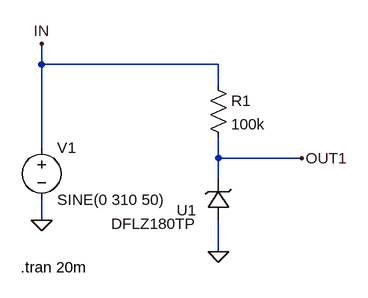
[diagram p0: schematic DFLZ180TP.asc]
DFLZ180TP.asc, the LTspice schematic file:
Version 4.1
SHEET 1 880 680
WIRE -16 32 -16 0
WIRE 256 32 -16 32
WIRE 256 64 256 32
WIRE -16 160 -16 32
WIRE 256 176 256 144
WIRE 384 176 256 176
WIRE 256 208 256 176
WIRE -16 272 -16 240
WIRE 256 320 256 272
FLAG -16 272 0
FLAG 256 320 0
FLAG 384 176 OUT1
FLAG -16 0 IN
SYMBOL voltage -16 144 R0
WINDOW 123 0 0 Left 0
WINDOW 39 0 0 Left 0
SYMATTR InstName V1
SYMATTR Value SINE(0 310 50)
SYMBOL res 240 48 R0
SYMATTR InstName R1
SYMATTR Value 100k
SYMBOL MyLib\\Diode_Zener\\DFLZ180TP 272 272 R180
WINDOW 38 49 -5 Left 2
SYMATTR InstName U1
TEXT -48 344 Left 2 !.tran 20m

The netlist it stands for:
* DFLZ180TP.asc
V1 IN 0 SINE(0 310 50)
R1 IN OUT1 100k
X§U1 0 OUT1 DFLZ180TP  ; pins + -
.tran 20m
.lib MyLib/Diode_Zener/DFLZ180TP.lib
.backanno
.end